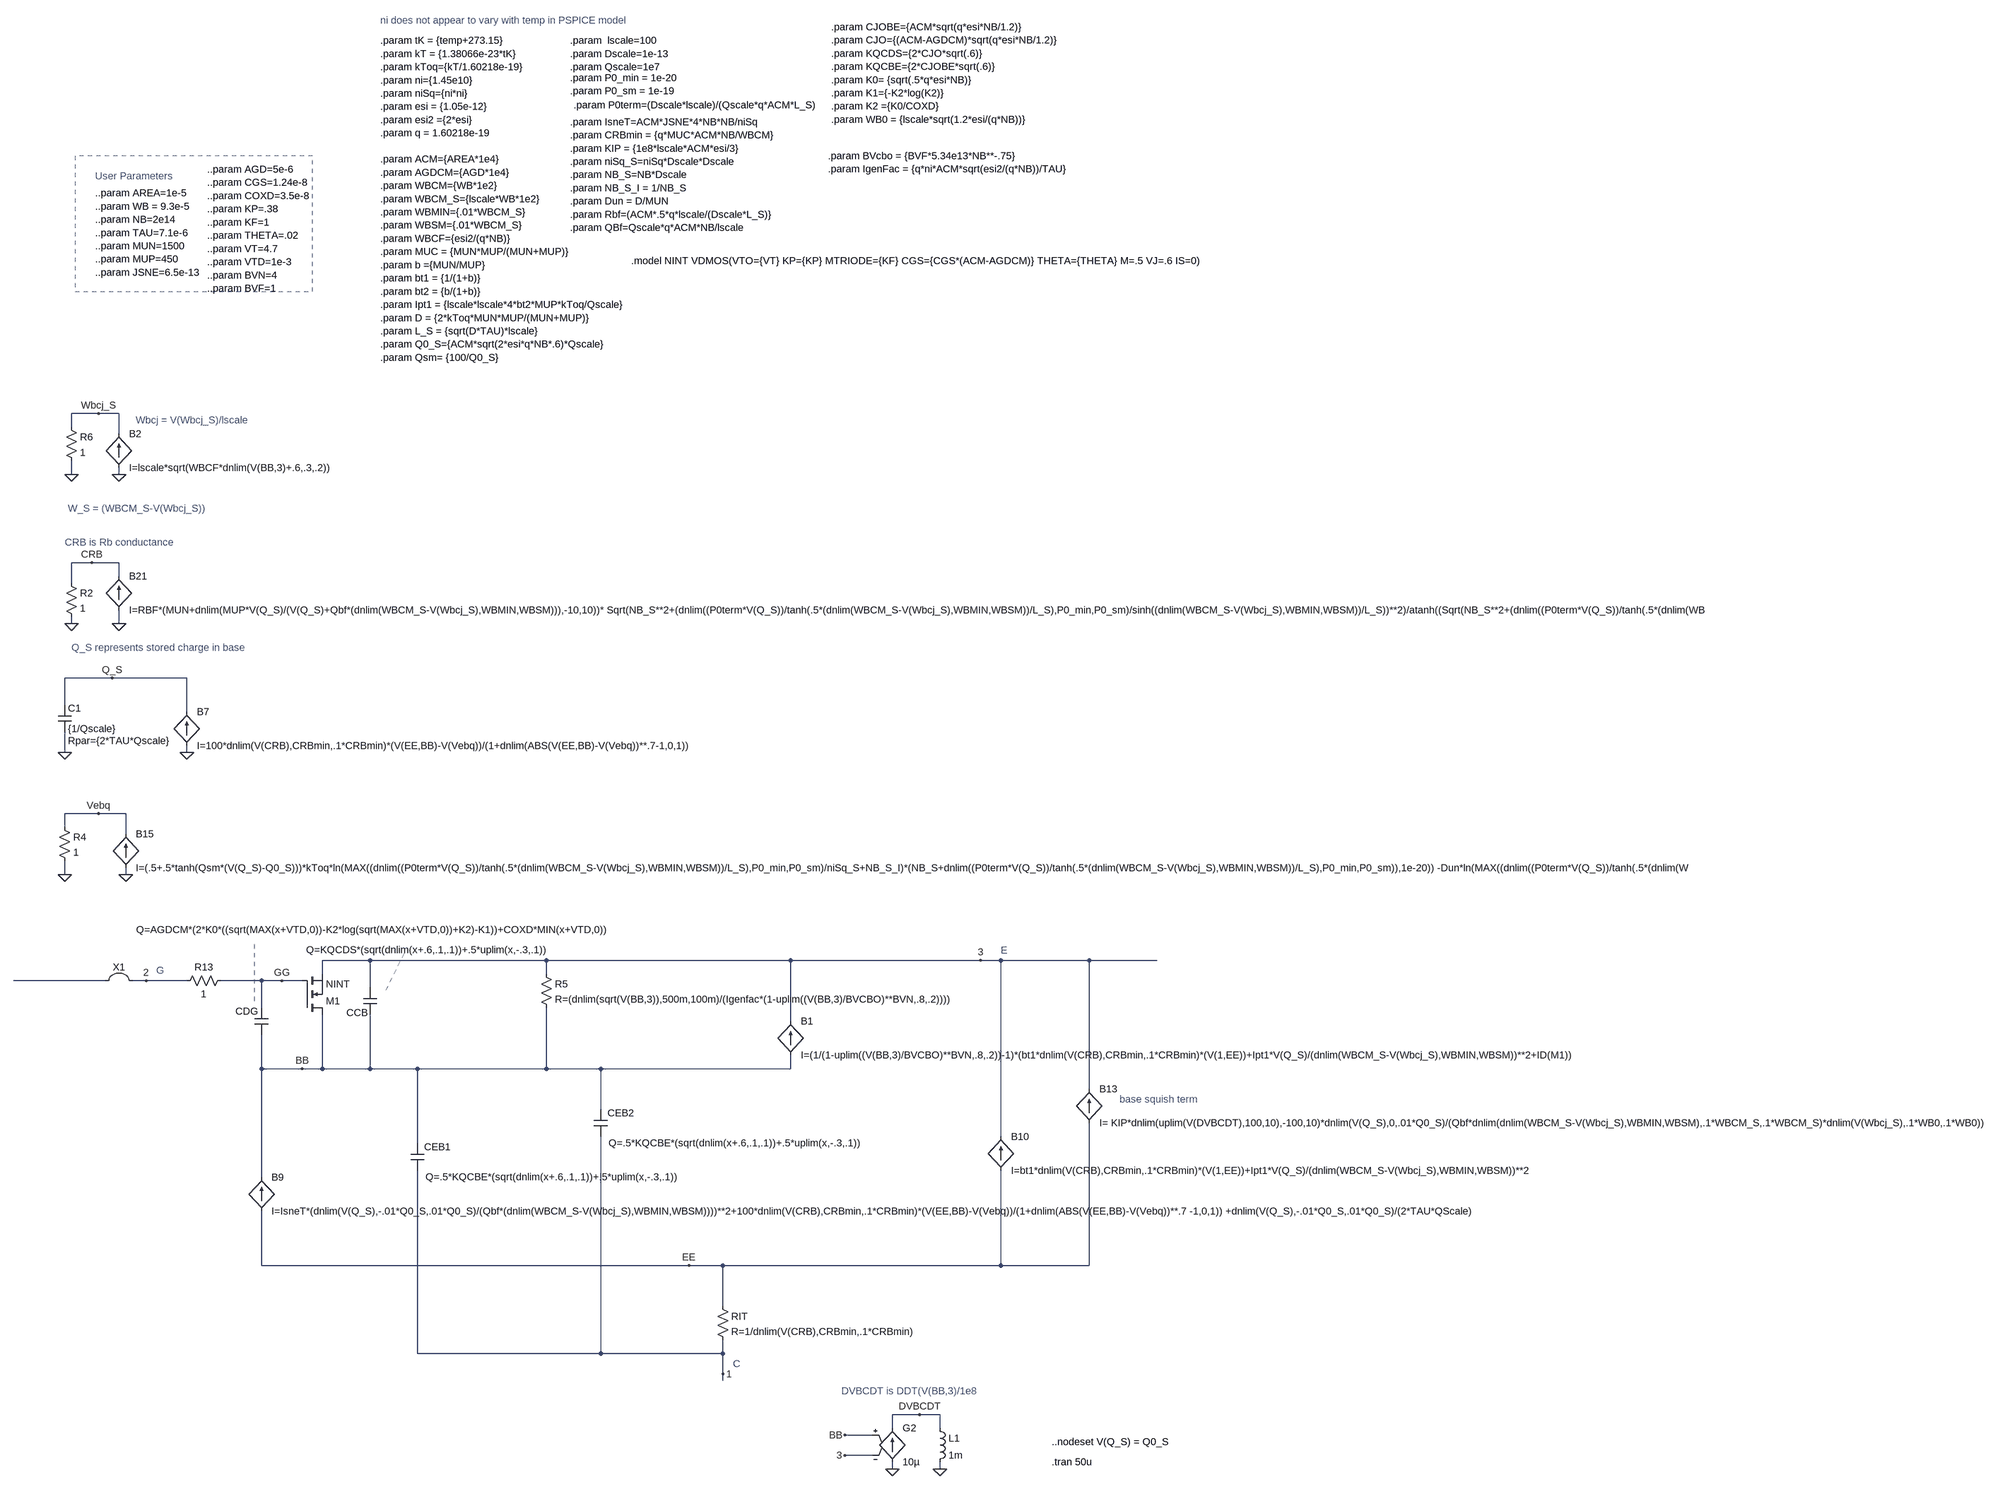
[diagram p0: schematic builtin_03_BobIGBT.asc]
builtin_03_BobIGBT.asc, the LTspice schematic file:
Version 4
SHEET 1 11056 3492
WIRE -1344 688 -1408 688
WIRE -1296 688 -1344 688
WIRE -1408 720 -1408 688
WIRE -1296 736 -1296 688
WIRE -1408 832 -1408 800
WIRE -1296 832 -1296 816
WIRE -1360 1040 -1408 1040
WIRE -1296 1040 -1360 1040
WIRE -1296 1072 -1296 1040
WIRE -1408 1088 -1408 1040
WIRE -1408 1184 -1408 1168
WIRE -1296 1184 -1296 1152
WIRE -1312 1312 -1424 1312
WIRE -1136 1312 -1312 1312
WIRE -1424 1376 -1424 1312
WIRE -1136 1392 -1136 1312
WIRE -1424 1488 -1424 1440
WIRE -1136 1488 -1136 1472
WIRE -1344 1632 -1424 1632
WIRE -1280 1632 -1344 1632
WIRE -1424 1664 -1424 1632
WIRE -1280 1680 -1280 1632
WIRE -1424 1776 -1424 1744
WIRE -1280 1776 -1280 1760
WIRE -704 2000 -816 2000
WIRE -288 2000 -704 2000
WIRE 288 2000 -288 2000
WIRE 736 2000 288 2000
WIRE 784 2000 736 2000
WIRE 992 2000 784 2000
WIRE 1152 2000 992 2000
WIRE -816 2032 -816 2000
WIRE -288 2032 -288 2000
WIRE -1328 2048 -1648 2048
WIRE -1232 2048 -1264 2048
WIRE -1136 2048 -1232 2048
WIRE -960 2048 -1056 2048
WIRE -912 2048 -960 2048
WIRE -864 2048 -912 2048
WIRE -704 2064 -704 2000
WIRE -960 2112 -960 2048
WIRE 288 2144 288 2000
WIRE -960 2256 -960 2176
WIRE -864 2256 -960 2256
WIRE -816 2256 -816 2128
WIRE -816 2256 -864 2256
WIRE -704 2256 -704 2128
WIRE -704 2256 -816 2256
WIRE -592 2256 -704 2256
WIRE -288 2256 -288 2112
WIRE -288 2256 -592 2256
WIRE -160 2256 -288 2256
WIRE 288 2256 288 2224
WIRE 288 2256 -160 2256
WIRE 992 2304 992 2000
WIRE -160 2352 -160 2256
WIRE 784 2416 784 2000
WIRE -592 2432 -592 2256
WIRE -960 2512 -960 2256
WIRE -960 2720 -960 2592
WIRE 48 2720 -960 2720
WIRE 128 2720 48 2720
WIRE 784 2720 784 2496
WIRE 784 2720 128 2720
WIRE 992 2720 992 2384
WIRE 992 2720 784 2720
WIRE 128 2816 128 2720
WIRE -592 2928 -592 2496
WIRE -160 2928 -160 2416
WIRE -160 2928 -592 2928
WIRE 128 2928 128 2896
WIRE 128 2928 -160 2928
WIRE 128 2976 128 2928
WIRE 128 2992 128 2976
WIRE 592 3072 528 3072
WIRE 640 3072 592 3072
WIRE 528 3104 528 3072
WIRE 640 3104 640 3072
WIRE 480 3120 416 3120
WIRE 480 3168 416 3168
WIRE 528 3200 528 3184
WIRE 640 3200 640 3184
FLAG -1424 1488 0
FLAG -1312 1312 Q_S
FLAG -1136 1488 0
FLAG 128 2976 1
FLAG 736 2000 3
FLAG -1424 1776 0
FLAG -1280 1776 0
FLAG -1344 1632 Vebq
FLAG 592 3072 DVBCDT
FLAG 48 2720 EE
FLAG -1232 2048 2
FLAG -864 2256 BB
FLAG -912 2048 GG
FLAG 640 3200 0
FLAG 528 3200 0
FLAG 416 3120 BB
FLAG 416 3168 3
FLAG -1408 1184 0
FLAG -1296 1184 0
FLAG -1360 1040 CRB
FLAG -1344 688 Wbcj_S
FLAG -1408 832 0
FLAG -1296 832 0
SYMBOL cap -1440 1376 R0
WINDOW 123 24 84 Left 2
SYMATTR Value2 Rpar={2*TAU*Qscale}
SYMATTR InstName C1
SYMATTR Value {1/Qscale}
SYMBOL bi -1136 1472 M180
WINDOW 0 24 80 Left 2
WINDOW 3 24 0 Left 2
SYMATTR InstName B7
SYMATTR Value I=100*dnlim(V(CRB),CRBmin,.1*CRBmin)*(V(EE,BB)-V(Vebq))/(1+dnlim(ABS(V(EE,BB)-V(Vebq))**.7-1,0,1))
SYMBOL bi -960 2592 M180
WINDOW 0 24 80 Left 2
WINDOW 3 24 0 Left 2
SYMATTR InstName B9
SYMATTR Value I=IsneT*(dnlim(V(Q_S),-.01*Q0_S,.01*Q0_S)/(Qbf*(dnlim(WBCM_S-V(Wbcj_S),WBMIN,WBSM))))**2+100*dnlim(V(CRB),CRBmin,.1*CRBmin)*(V(EE,BB)-V(Vebq))/(1+dnlim(ABS(V(EE,BB)-V(Vebq))**.7 -1,0,1)) +dnlim(V(Q_S),-.01*Q0_S,.01*Q0_S)/(2*TAU*QScale)
SYMBOL bi 784 2496 M180
WINDOW 0 24 80 Left 2
WINDOW 3 24 0 Left 2
SYMATTR InstName B10
SYMATTR Value I=bt1*dnlim(V(CRB),CRBmin,.1*CRBmin)*(V(1,EE))+Ipt1*V(Q_S)/(dnlim(WBCM_S-V(Wbcj_S),WBMIN,WBSM))**2
SYMBOL bi -1280 1760 M180
WINDOW 0 24 80 Left 2
WINDOW 3 24 0 Left 2
SYMATTR InstName B15
SYMATTR Value I=(.5+.5*tanh(Qsm*(V(Q_S)-Q0_S)))*kToq*ln(MAX((dnlim((P0term*V(Q_S))/tanh(.5*(dnlim(WBCM_S-V(Wbcj_S),WBMIN,WBSM))/L_S),P0_min,P0_sm)/niSq_S+NB_S_I)*(NB_S+dnlim((P0term*V(Q_S))/tanh(.5*(dnlim(WBCM_S-V(Wbcj_S),WBMIN,WBSM))/L_S),P0_min,P0_sm)),1e-20)) -Dun*ln(MAX((dnlim((P0term*V(Q_S))/tanh(.5*(dnlim(WBCM_S-V(Wbcj_S),WBMIN,WBSM))/L_S),P0_min,P0_sm)+NB_S)/NB_S,1e-20)) +(.5-.5*tanh(Qsm*(V(Q_S)-Q0_S)))*MIN(kToq*ln(MAX((dnlim((P0term*V(Q_S))/tanh(.5*(dnlim(WBCM_S-V(Wbcj_S),WBMIN,WBSM))/L_S),P0_min,P0_sm)/niSq_S+NB_S_I)*(NB_S+dnlim((P0term*V(Q_S))/tanh(.5*(dnlim(WBCM_S-V(Wbcj_S),WBMIN,WBSM))/L_S),P0_min,P0_sm)),1e-20)) -Dun*ln(dnlim((dnlim((P0term*V(Q_S))/tanh(.5*(dnlim(WBCM_S-V(Wbcj_S),WBMIN,WBSM))/L_S),P0_min,P0_sm)+NB_S)/NB_S,1e-20,1e-20))  ,V(1,BB))+2p*V(3,EE)
SYMBOL bi 992 2384 M180
WINDOW 0 24 80 Left 2
WINDOW 3 24 0 Left 2
SYMATTR InstName B13
SYMATTR Value I= KIP*dnlim(uplim(V(DVBCDT),100,10),-100,10)*dnlim(V(Q_S),0,.01*Q0_S)/(Qbf*dnlim(dnlim(WBCM_S-V(Wbcj_S),WBMIN,WBSM),.1*WBCM_S,.1*WBCM_S)*dnlim(V(Wbcj_S),.1*WB0,.1*WB0))
SYMBOL jumper -1296 1984 R0
SYMATTR InstName X1
SYMBOL cap -944 2176 R180
WINDOW 0 24 56 Left 2
WINDOW 3 -793 248 Left 2
SYMATTR InstName CDG
SYMATTR Value Q=AGDCM*(2*K0*((sqrt(MAX(x+VTD,0))-K2*log(sqrt(MAX(x+VTD,0))+K2)-K1))+COXD*MIN(x+VTD,0))
SYMBOL res -1040 2032 R90
WINDOW 0 0 56 VBottom 2
WINDOW 3 32 56 VTop 2
SYMATTR InstName R13
SYMATTR Value 1
SYMBOL nmos -864 2128 M180
SYMATTR InstName M1
SYMATTR Value NINT
SYMBOL g 528 3088 R0
SYMATTR InstName G2
SYMATTR Value 10µ
SYMBOL ind 624 3088 R0
SYMATTR InstName L1
SYMATTR Value 1m
SYMBOL bi -1296 1152 M180
WINDOW 0 24 80 Left 2
WINDOW 3 24 0 Left 2
SYMATTR InstName B21
SYMATTR Value I=RBF*(MUN+dnlim(MUP*V(Q_S)/(V(Q_S)+Qbf*(dnlim(WBCM_S-V(Wbcj_S),WBMIN,WBSM))),-10,10))* Sqrt(NB_S**2+(dnlim((P0term*V(Q_S))/tanh(.5*(dnlim(WBCM_S-V(Wbcj_S),WBMIN,WBSM))/L_S),P0_min,P0_sm)/sinh((dnlim(WBCM_S-V(Wbcj_S),WBMIN,WBSM))/L_S))**2)/atanh((Sqrt(NB_S**2+(dnlim((P0term*V(Q_S))/tanh(.5*(dnlim(WBCM_S-V(Wbcj_S),WBMIN,WBSM))/L_S),P0_min,P0_sm)/sinh((dnlim(WBCM_S-V(Wbcj_S),WBMIN,WBSM))/L_S))**2)*tanh(.5*(dnlim(WBCM_S-V(Wbcj_S),WBMIN,WBSM))/L_S))/(NB_S+dnlim((P0term*V(Q_S))/tanh(.5*(dnlim(WBCM_S-V(Wbcj_S),WBMIN,WBSM))/L_S),P0_min,P0_sm)*tanh(.5*(dnlim(WBCM_S-V(Wbcj_S),WBMIN,WBSM))/L_S)/sinh((dnlim(WBCM_S-V(Wbcj_S),WBMIN,WBSM))/L_S)))
SYMBOL res 112 2800 R0
SYMATTR InstName RIT
SYMATTR Value R=1/dnlim(V(CRB),CRBmin,.1*CRBmin)
SYMBOL bi 288 2224 M180
WINDOW 0 24 80 Left 2
WINDOW 3 24 0 Left 2
SYMATTR InstName B1
SYMATTR Value I=(1/(1-uplim((V(BB,3)/BVCBO)**BVN,.8,.2))-1)*(bt1*dnlim(V(CRB),CRBmin,.1*CRBmin)*(V(1,EE))+Ipt1*V(Q_S)/(dnlim(WBCM_S-V(Wbcj_S),WBMIN,WBSM))**2+ID(M1))
SYMBOL res -1440 1648 R0
SYMATTR InstName R4
SYMATTR Value 1
SYMBOL res -1424 1072 R0
SYMATTR InstName R2
SYMATTR Value 1
SYMBOL res -304 2016 R0
SYMATTR InstName R5
SYMATTR Value R=(dnlim(sqrt(V(BB,3)),500m,100m)/(Igenfac*(1-uplim((V(BB,3)/BVCBO)**BVN,.8,.2))))
SYMBOL bi -1296 816 M180
WINDOW 0 24 80 Left 2
WINDOW 3 24 0 Left 2
SYMATTR InstName B2
SYMATTR Value I=lscale*sqrt(WBCF*dnlim(V(BB,3)+.6,.3,.2))
SYMBOL res -1424 704 R0
SYMATTR InstName R6
SYMATTR Value 1
SYMBOL cap -688 2128 R180
WINDOW 3 -400 153 Left 2
WINDOW 123 65 256 Left 2
WINDOW 0 21 4 Left 2
SYMATTR Value Q=KQCDS*(sqrt(dnlim(x+.6,.1,.1))+.5*uplim(x,-.3,.1))
SYMATTR InstName CCB
SYMBOL cap -608 2432 R0
WINDOW 3 35 79 Left 2
WINDOW 123 65 256 Left 2
WINDOW 0 32 8 Left 2
SYMATTR Value Q=.5*KQCBE*(sqrt(dnlim(x+.6,.1,.1))+.5*uplim(x,-.3,.1))
SYMATTR InstName CEB1
SYMBOL cap -176 2352 R0
WINDOW 3 35 79 Left 2
WINDOW 123 65 256 Left 2
WINDOW 0 32 8 Left 2
SYMATTR Value Q=.5*KQCBE*(sqrt(dnlim(x+.6,.1,.1))+.5*uplim(x,-.3,.1))
SYMATTR InstName CEB2
TEXT -232 0 Left 2 !.param IsneT=ACM*JSNE*4*NB*NB/niSq\n.param CRBmin = {q*MUC*ACM*NB/WBCM}\n.param KIP = {1e8*lscale*ACM*esi/3}\n.param niSq_S=niSq*Dscale*Dscale\n.param NB_S=NB*Dscale\n.param NB_S_I = 1/NB_S\n.param Dun = D/MUN\n.param Rbf=(ACM*.5*q*lscale/(Dscale*L_S)}\n.param QBf=Qscale*q*ACM*NB/lscale
TEXT -680 -192 Left 2 !.param tK = {temp+273.15}\n.param kT = {1.38066e-23*tK}\n.param kToq={kT/1.60218e-19}\n.param ni={1.45e10}\n.param niSq={ni*ni}\n.param esi = {1.05e-12}\n.param esi2 ={2*esi}\n.param q = 1.60218e-19
TEXT -1424 992 Left 2 ;CRB is Rb conductance
TEXT -1352 168 Left 2 !..param AREA=1e-5\n..param WB = 9.3e-5\n..param NB=2e14\n..param TAU=7.1e-6\n..param MUN=1500\n..param MUP=450\n..param JSNE=6.5e-13
TEXT -1352 128 Left 2 ;User Parameters
TEXT -680 88 Left 2 !.param ACM={AREA*1e4}\n.param AGDCM={AGD*1e4}\n.param WBCM={WB*1e2}\n.param WBCM_S={lscale*WB*1e2}\n.param WBMIN={.01*WBCM_S}\n.param WBSM={.01*WBCM_S}\n.param WBCF={esi2/(q*NB)}\n.param MUC = {MUN*MUP/(MUN+MUP)}\n.param b ={MUN/MUP}\n.param bt1 = {1/(1+b)}\n.param bt2 = {b/(1+b)}\n.param Ipt1 = {lscale*lscale*4*bt2*MUP*kToq/Qscale}\n.param D = {2*kToq*MUN*MUP/(MUN+MUP)}\n.param L_S = {sqrt(D*TAU)*lscale}\n.param Q0_S={ACM*sqrt(2*esi*q*NB*.6)*Qscale}\n.param Qsm= {100/Q0_S}
TEXT -232 -104 Left 2 !.param P0_min = 1e-20\n.param P0_sm = 1e-19
TEXT 904 3184 Left 2 !.tran 50u
TEXT 784 1976 Left 2 ;E
TEXT 152 2952 Left 2 ;C
TEXT -1408 1240 Left 2 ;Q_S represents stored charge in base
TEXT 1064 2328 Left 2 ;base squish term
TEXT 408 3016 Left 2 ;DVBCDT is DDT(V(BB,3)/1e8
TEXT 904 3136 Left 2 !..nodeset V(Q_S) = Q0_S
TEXT -232 -192 Left 2 !.param  lscale=100\n.param Dscale=1e-13\n.param Qscale=1e7
TEXT -680 -240 Left 2 ;ni does not appear to vary with temp in PSPICE model
TEXT -1208 2024 Left 2 ;G
TEXT -88 328 Left 2 !.model NINT VDMOS(VTO={VT} KP={KP} MTRIODE={KF} CGS={CGS*(ACM-AGDCM)} THETA={THETA} M=.5 VJ=.6 IS=0)
TEXT 384 -224 Left 2 !.param CJOBE={ACM*sqrt(q*esi*NB/1.2)}\n.param CJO={(ACM-AGDCM)*sqrt(q*esi*NB/1.2)}\n.param KQCDS={2*CJO*sqrt(.6)}\n.param KQCBE={2*CJOBE*sqrt(.6)}\n.param K0= {sqrt(.5*q*esi*NB)}\n.param K1={-K2*log(K2)}\n.param K2 ={K0/COXD}\n.param WB0 = {lscale*sqrt(1.2*esi/(q*NB))}
TEXT -224 -40 Left 2 !.param P0term=(Dscale*lscale)/(Qscale*q*ACM*L_S)
TEXT 376 80 Left 2 !.param BVcbo = {BVF*5.34e13*NB**-.75}\n.param IgenFac = {q*ni*ACM*sqrt(esi2/(q*NB))/TAU}
TEXT -1088 112 Left 2 !..param AGD=5e-6\n..param CGS=1.24e-8\n..param COXD=3.5e-8\n..param KP=.38\n..param KF=1\n..param THETA=.02\n..param VT=4.7\n..param VTD=1e-3\n..param BVN=4\n..param BVF=1
TEXT -1416 912 Left 2 ;W_S = (WBCM_S-V(Wbcj_S))
TEXT -1256 704 Left 2 ;Wbcj = V(Wbcj_S)/lscale
LINE Normal -976 2096 -976 1952 2
LINE Normal -624 1984 -672 2080 2
LINE Normal -624 1984 -624 1984 2
RECTANGLE Normal -840 80 -1400 400 2

The netlist it stands for:
* builtin_03_BobIGBT.asc
C1 Q_S 0 {1/Qscale} Rpar={2*TAU*Qscale}
B7 0 Q_S I=100*dnlim(V(CRB),CRBmin,.1*CRBmin)*(V(EE,BB)-V(Vebq))/(1+dnlim(ABS(V(EE,BB)-V(Vebq))**.7-1,0,1))
B9 EE BB I=IsneT*(dnlim(V(Q_S),-.01*Q0_S,.01*Q0_S)/(Qbf*(dnlim(WBCM_S-V(Wbcj_S),WBMIN,WBSM))))**2+100*dnlim(V(CRB),CRBmin,.1*CRBmin)*(V(EE,BB)-V(Vebq))/(1+dnlim(ABS(V(EE,BB)-V(Vebq))**.7 -1,0,1)) +dnlim(V(Q_S),-.01*Q0_S,.01*Q0_S)/(2*TAU*QScale)
B10 EE 3 I=bt1*dnlim(V(CRB),CRBmin,.1*CRBmin)*(V(1,EE))+Ipt1*V(Q_S)/(dnlim(WBCM_S-V(Wbcj_S),WBMIN,WBSM))**2
B15 0 Vebq I=(.5+.5*tanh(Qsm*(V(Q_S)-Q0_S)))*kToq*ln(MAX((dnlim((P0term*V(Q_S))/tanh(.5*(dnlim(WBCM_S-V(Wbcj_S),WBMIN,WBSM))/L_S),P0_min,P0_sm)/niSq_S+NB_S_I)*(NB_S+dnlim((P0term*V(Q_S))/tanh(.5*(dnlim(WBCM_S-V(Wbcj_S),WBMIN,WBSM))/L_S),P0_min,P0_sm)),1e-20)) -Dun*ln(MAX((dnlim((P0term*V(Q_S))/tanh(.5*(dnlim(WBCM_S-V(Wbcj_S),WBMIN,WBSM))/L_S),P0_min,P0_sm)+NB_S)/NB_S,1e-20)) +(.5-.5*tanh(Qsm*(V(Q_S)-Q0_S)))*MIN(kToq*ln(MAX((dnlim((P0term*V(Q_S))/tanh(.5*(dnlim(WBCM_S-V(Wbcj_S),WBMIN,WBSM))/L_S),P0_min,P0_sm)/niSq_S+NB_S_I)*(NB_S+dnlim((P0term*V(Q_S))/tanh(.5*(dnlim(WBCM_S-V(Wbcj_S),WBMIN,WBSM))/L_S),P0_min,P0_sm)),1e-20)) -Dun*ln(dnlim((dnlim((P0term*V(Q_S))/tanh(.5*(dnlim(WBCM_S-V(Wbcj_S),WBMIN,WBSM))/L_S),P0_min,P0_sm)+NB_S)/NB_S,1e-20,1e-20))  ,V(1,BB))+2p*V(3,EE)
B13 EE 3 I= KIP*dnlim(uplim(V(DVBCDT),100,10),-100,10)*dnlim(V(Q_S),0,.01*Q0_S)/(Qbf*dnlim(dnlim(WBCM_S-V(Wbcj_S),WBMIN,WBSM),.1*WBCM_S,.1*WBCM_S)*dnlim(V(Wbcj_S),.1*WB0,.1*WB0))
CDG BB GG Q=AGDCM*(2*K0*((sqrt(MAX(x+VTD,0))-K2*log(sqrt(MAX(x+VTD,0))+K2)-K1))+COXD*MIN(x+VTD,0))
R13 GG 2 1
M1 BB GG 3 3 NINT
G2 0 DVBCDT BB 3 10µ
L1 DVBCDT 0 1m
B21 0 CRB I=RBF*(MUN+dnlim(MUP*V(Q_S)/(V(Q_S)+Qbf*(dnlim(WBCM_S-V(Wbcj_S),WBMIN,WBSM))),-10,10))* Sqrt(NB_S**2+(dnlim((P0term*V(Q_S))/tanh(.5*(dnlim(WBCM_S-V(Wbcj_S),WBMIN,WBSM))/L_S),P0_min,P0_sm)/sinh((dnlim(WBCM_S-V(Wbcj_S),WBMIN,WBSM))/L_S))**2)/atanh((Sqrt(NB_S**2+(dnlim((P0term*V(Q_S))/tanh(.5*(dnlim(WBCM_S-V(Wbcj_S),WBMIN,WBSM))/L_S),P0_min,P0_sm)/sinh((dnlim(WBCM_S-V(Wbcj_S),WBMIN,WBSM))/L_S))**2)*tanh(.5*(dnlim(WBCM_S-V(Wbcj_S),WBMIN,WBSM))/L_S))/(NB_S+dnlim((P0term*V(Q_S))/tanh(.5*(dnlim(WBCM_S-V(Wbcj_S),WBMIN,WBSM))/L_S),P0_min,P0_sm)*tanh(.5*(dnlim(WBCM_S-V(Wbcj_S),WBMIN,WBSM))/L_S)/sinh((dnlim(WBCM_S-V(Wbcj_S),WBMIN,WBSM))/L_S)))
RIT EE 1 R=1/dnlim(V(CRB),CRBmin,.1*CRBmin)
B1 BB 3 I=(1/(1-uplim((V(BB,3)/BVCBO)**BVN,.8,.2))-1)*(bt1*dnlim(V(CRB),CRBmin,.1*CRBmin)*(V(1,EE))+Ipt1*V(Q_S)/(dnlim(WBCM_S-V(Wbcj_S),WBMIN,WBSM))**2+ID(M1))
R4 Vebq 0 1
R2 CRB 0 1
R5 3 BB R=(dnlim(sqrt(V(BB,3)),500m,100m)/(Igenfac*(1-uplim((V(BB,3)/BVCBO)**BVN,.8,.2))))
B2 0 Wbcj_S I=lscale*sqrt(WBCF*dnlim(V(BB,3)+.6,.3,.2))
R6 Wbcj_S 0 1
CCB BB 3 Q=KQCDS*(sqrt(dnlim(x+.6,.1,.1))+.5*uplim(x,-.3,.1))
CEB1 BB 1 Q=.5*KQCBE*(sqrt(dnlim(x+.6,.1,.1))+.5*uplim(x,-.3,.1))
CEB2 BB 1 Q=.5*KQCBE*(sqrt(dnlim(x+.6,.1,.1))+.5*uplim(x,-.3,.1))
.model NMOS NMOS
.model PMOS PMOS
.lib standard.mos
.param IsneT=ACM*JSNE*4*NB*NB/niSq
.param CRBmin = {q*MUC*ACM*NB/WBCM}
.param KIP = {1e8*lscale*ACM*esi/3}
.param niSq_S=niSq*Dscale*Dscale
.param NB_S=NB*Dscale
.param NB_S_I = 1/NB_S
.param Dun = D/MUN
.param Rbf=(ACM*.5*q*lscale/(Dscale*L_S)}
.param QBf=Qscale*q*ACM*NB/lscale
.param tK = {temp+273.15}
.param kT = {1.38066e-23*tK}
.param kToq={kT/1.60218e-19}
.param ni={1.45e10}
.param niSq={ni*ni}
.param esi = {1.05e-12}
.param esi2 ={2*esi}
.param q = 1.60218e-19
* CRB is Rb conductance
..param AREA=1e-5
..param WB = 9.3e-5
..param NB=2e14
..param TAU=7.1e-6
..param MUN=1500
..param MUP=450
..param JSNE=6.5e-13
* User Parameters
.param ACM={AREA*1e4}
.param AGDCM={AGD*1e4}
.param WBCM={WB*1e2}
.param WBCM_S={lscale*WB*1e2}
.param WBMIN={.01*WBCM_S}
.param WBSM={.01*WBCM_S}
.param WBCF={esi2/(q*NB)}
.param MUC = {MUN*MUP/(MUN+MUP)}
.param b ={MUN/MUP}
.param bt1 = {1/(1+b)}
.param bt2 = {b/(1+b)}
.param Ipt1 = {lscale*lscale*4*bt2*MUP*kToq/Qscale}
.param D = {2*kToq*MUN*MUP/(MUN+MUP)}
.param L_S = {sqrt(D*TAU)*lscale}
.param Q0_S={ACM*sqrt(2*esi*q*NB*.6)*Qscale}
.param Qsm= {100/Q0_S}
.param P0_min = 1e-20
.param P0_sm = 1e-19
.tran 50u
* E
* C
* Q_S represents stored charge in base
* base squish term
* DVBCDT is DDT(V(BB,3)/1e8
..nodeset V(Q_S) = Q0_S
.param  lscale=100
.param Dscale=1e-13
.param Qscale=1e7
* ni does not appear to vary with temp in PSPICE model
* G
.model NINT VDMOS(VTO={VT} KP={KP} MTRIODE={KF} CGS={CGS*(ACM-AGDCM)} THETA={THETA} M=.5 VJ=.6 IS=0)
.param CJOBE={ACM*sqrt(q*esi*NB/1.2)}
.param CJO={(ACM-AGDCM)*sqrt(q*esi*NB/1.2)}
.param KQCDS={2*CJO*sqrt(.6)}
.param KQCBE={2*CJOBE*sqrt(.6)}
.param K0= {sqrt(.5*q*esi*NB)}
.param K1={-K2*log(K2)}
.param K2 ={K0/COXD}
.param WB0 = {lscale*sqrt(1.2*esi/(q*NB))}
.param P0term=(Dscale*lscale)/(Qscale*q*ACM*L_S)
.param BVcbo = {BVF*5.34e13*NB**-.75}
.param IgenFac = {q*ni*ACM*sqrt(esi2/(q*NB))/TAU}
..param AGD=5e-6
..param CGS=1.24e-8
..param COXD=3.5e-8
..param KP=.38
..param KF=1
..param THETA=.02
..param VT=4.7
..param VTD=1e-3
..param BVN=4
..param BVF=1
* W_S = (WBCM_S-V(Wbcj_S))
* Wbcj = V(Wbcj_S)/lscale
.backanno
.end